# EasyEDA Pro project EMG_frontend.eprj, board EMG_channel_final_1
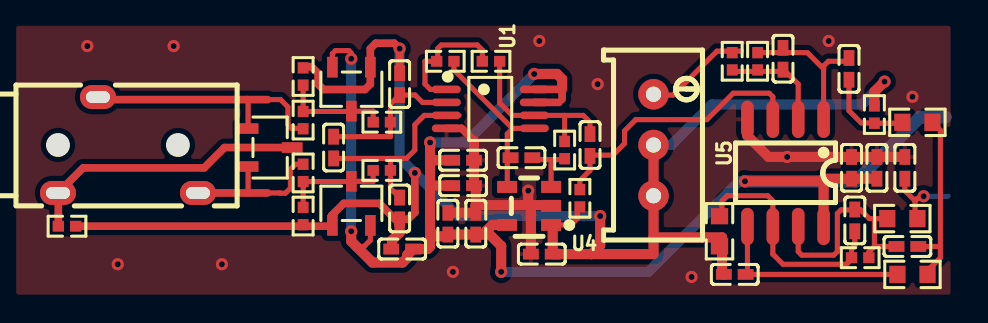
[diagram p4: board, top side]
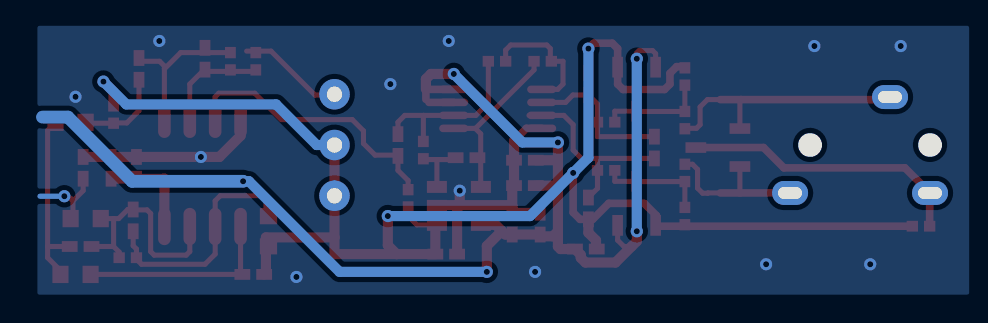
[diagram p5: board, bottom side, seen from below]

Outline 7.19 x 1.19 mm; copper layers: Top Layer, Bottom Layer. Coordinates in mm from the lower left corner of the outline.
Stack: Top Layer 0.035mm / Dielectric1 1.51mm FR4 er 4.5 / Bottom Layer 0.035mm

## Design rules (mm)
template: JLCPCB Capability(Two Layers Board)
spacing copperThickness1oz (default): track to track 0.102, other pairs 0.152 to 0.3
spacing copperThickness2oz: track to track 0.203, other pairs 0.152 to 0.3
track width copperThickness1oz (default): min 0.127, default 0.254, max 2.54
track width copperThickness2oz: min 0.203, default 0.254, max 2.54
differential pair differentialPair (default): width min 0.127, default 0.254, max 2.54; gap min 0.152, default 0.152
via viaSize (default): diameter min 0.5, default 0.61, max 10; hole min 0.3, default 0.305, max 6.3

## Placement (name value [footprint] x y rotation side)
C1  1uF  [C0402]  23.78 -0.04 0 top
C2  1uF  [C0402]  20.86 -1.44 0 top
C3  100nF  [C0402]  20.86 -0.17 0 top
C4  1uF  [C0402]  21.49 -3.34 90 top
C5  100nF  [C0402]  20.1 -3.34 90 top
C6  1uF  [C0402]  27.21 0.59 270 top
C7  1uF  [C0402]  40.16 4.4 270 top
C8  1nF  [C0402]  36.86 4.91 90 top
C9  1uF  [C0402]  40.29 -0.55 90 top
C10  100nF  [C0402]  41.56 -0.55 90 top
C11  10nF  [C0402]  43.08 -4.49 180 top
C12  10nF  [C0402]  34.45 -5.88 0 top
C13  1nF  [C0402]  40.45 -3.18 90 top
C14  1uF  [C0402]  42.96 -0.55 270 top
C15  10nF  [C0402]  14.38 0.47 90 top
C16  100pF  [C0402]  17.68 -2.58 270 top
C17  100pF  [C0402]  17.68 3.64 270 top
C18  100nF  [C0402]  24.8 -4.87 0 top
C19  100nF  [C0402]  17.81 -4.61 180 top
D1  PSM712-LF-T7  [SOT-23-3_L3.0-W1.7-P0.95-LS2.9-BR]  11.21 0.47 180 top
D3  BAV70  [SOT-23-3_L3.0-W1.7-P0.95-LS2.9-BR]  15.27 3.39 90 top
D4  BAV70  [SOT-23-3_L3.0-W1.7-P0.95-LS2.9-BR]  15.27 -2.33 270 top
J1  320B直插  [AUDIO-TH_PJ-3200]  4.09 0.59 0 top
R1  10kΩ  [R0402]  19.97 4.79 0 top
R2  10kΩ  [R0402]  22.26 4.79 180 top
R3  100kΩ  [R0402]  25.94 0.34 90 top
R4  100kΩ  [R0402]  26.7 -2.07 90 top
R5  100kΩ  [R0402]  41.43 2.12 270 top
R6  20kΩ  [RES-ADJ-TH_3P-L9.5-W4.85-P2.54_PV36W103C01B00]  30.38 0.59 0 top
R7  1kΩ  [R0402]  34.32 4.79 270 top
R8  100kΩ  [R0402]  35.59 4.79 90 top
R9  56kΩ  [R0603]  43.58 1.73 0 top
R10  330kΩ  [R0603]  43.34 -5.88 180 top
R11  3.9kΩ  [R0603]  33.69 -3.72 90 top
R12  10kΩ  [R0402]  40.72 -5.05 180 top
R13  3.9kΩ  [R0603]  42.83 -3.09 0 top
R19  1MΩ  [R0402]  12.86 4.02 90 top
R20  1MΩ  [R0402]  12.86 -2.96 90 top
R21  2kΩ  [R0402]  12.86 1.84 90 top
R22  2kΩ  [R0402]  1.05 -3.47 0 top
R23  2kΩ  [R0402]  12.86 -0.8 270 top
R24  2kΩ  [R0402]  16.79 -0.68 0 top
R25  2kΩ  [R0402]  16.79 1.74 0 top
U1  INA331AIDGKT  [VSSOP-8_L3.0-W3.0-P0.65-LS4.9-BL]  22.22 2.4 270 top
U4  TPMCP6001UT-I/OT  [SOT-23-5_L2.9-W1.6-P0.95-LS2.8-BR]  24.16 -2.45 0 top
U5  MCP6002M/TR  [SOP-8_L4.9-W3.9-P1.27-LS6.0-BL]  36.99 -0.8 180 top

## Footprints (pads in the part's own frame, mm; a bottom-side part is the same pattern mirrored in y, then rotated)
AUDIO-TH_PJ-3200
  oval 1.8x1.2 hole 1.2x0.6: 2(-1.5,2.4) 3(-3.5,-2.4) 4(3.5,-2.4)
C0402
  rect 0.79x0.54 smd: 1(-0.545,0) 2(0.545,0)
R0402
  rect 0.566x0.54 smd: 1(-0.433,0) 2(0.433,0)
R0603
  rect 0.806x0.864 smd: 1(-0.753,0) 2(0.753,0)
RES-ADJ-TH_3P-L9.5-W4.85-P2.54_PV36W103C01B00
  round 1.524 hole 0.762: 1(0,2.54) 2(0,0) 3(0,-2.54)
SOP-8_L4.9-W3.9-P1.27-LS6.0-BL
  oval 0.63x1.865 smd: 1(-1.905,-2.683) 2(-0.635,-2.683) 3(0.635,-2.683) 4(1.905,-2.683) 5(1.905,2.683) 6(0.635,2.683) 7(-0.635,2.683) 8(-1.905,2.683)
SOT-23-3_L3.0-W1.7-P0.95-LS2.9-BR
  rect 1.038x0.532 smd: 1(1.101,-0.95) 2(1.101,0.95) 3(-1.101,0)
SOT-23-5_L2.9-W1.6-P0.95-LS2.8-BR
  rect 1x0.6 smd: 1(1.1,-0.95) 2(1.1,0) 3(1.1,0.95) 4(-1.1,0.95) 5(-1.1,-0.95)
VSSOP-8_L3.0-W3.0-P0.65-LS4.9-BL
  oval 0.38x1.45 smd: 1(-0.975,-2.2) 2(-0.325,-2.2) 3(0.325,-2.2) 4(0.975,-2.2) 5(0.975,2.2) 6(0.325,2.2) 7(-0.325,2.2) 8(-0.975,2.2)

## Nets
As in the schematic.

## Via types
v1: diameter 0.61, hole 0.305, Top Layer to Bottom Layer, 23 vias

## Routing (per net, layer and track width the routed paths; a pad name or vN(x,y) marks a point on that pad's centre or on a via; arc(x,y) is an arc through that point)
GND: length 22.7
  Top Layer w0.381: 20.02,1.43 20.79,1.43 21.4,0.81
  Top Layer w0.508: 24.25,-2.42 24.25,-2.42 24.25,-4.74 ; 24.25,-2.42 25.22,-2.42 U4.2 ; 24.25,-2.42 24.12,-2.29 v1(24.12,-1.69) ; 24.25,-2.42 21.49,-2.42 ; C5.2 C4.2 21.49,-2.42 ; 21.49,-2.42 21.49,-1.53 C2.2 C3.2 21.4,0.81 ; U5.4 35.08,1.05 36.14,0 v1(37.07,0) C9.2 C10.2 C14.1
  vias: v1(2.06,5.55) v1(3.59,-5.37) v1(6.38,5.55) v1(8.79,-5.37) v1(20.35,-5.76) v1(24.67,5.8) v1(27.59,3.64) v1(32.29,-6.01) v1(39.15,5.8) v1(43.34,3.01)
VCC: length 77.9
  Top Layer w0.254: v1(15.26,4.91) 15.26,5.2 15.14,5.32 14.47,5.32 14.32,5.17 D3.2 ; 16.22,-3.43 16.22,-4.17 15.91,-4.49 15.41,-4.49
  Top Layer w0.381: 25.81,2.88 25.81,3.39 25.8,3.38 U1.8 ; U1.7 25.66,2.73
  Top Layer w0.508: v1(19.21,0.72) 19.21,-0.27 ; 19.21,-0.27 19.31,-0.17 C3.1 ; 19.21,-0.27 19.21,-1.43 ; 25.81,3.39 25.81,3.9 25.56,4.15 v1(24.41,4.15) ; C2.1 19.21,-1.44 19.21,-1.43 ; v1(34.96,-1.22) 38.77,-1.22 38.89,-1.09 ; 22.02,-3.71 22.76,-4.46 v1(22.76,-5.76) ; 22.02,-3.71 22.32,-3.4 U4.5 ; 22.02,-3.71 21.84,-3.89 C4.1 C5.1 20.01,-3.98 19.46,-3.98 19.21,-3.72 ; v1(15.26,-3.72) 15.26,-4.22 16.33,-5.29 17.83,-5.29 18.07,-5.05 18.07,-4.9 C19.1 19.08,-4.61 19.21,-4.49 19.21,-3.72 ; 38.89,-1.09 C9.1 C10.1 ; 38.89,-1.09 U5.8 ; 19.21,-3.72 19.21,-1.43
  Bottom Layer w0.508: v1(15.26,4.91) v1(15.26,-3.72) ; v1(34.96,-1.22) 34.66,-1.22 30.13,-5.76 v1(22.76,-5.76) ; v1(24.41,4.15) 20.99,0.72 v1(19.21,0.72)
  Bottom Layer w0.635: v1(34.96,-1.22) 40.51,-1.22 43.72,1.99 44.99,1.99
C: length 14.3
  Top Layer w0.381: R22.1 0.61,-1.82 J1.3 1.85,-0.55 7.9,-0.55 8.92,0.47 D1.3
IN+: length 10.1
  Top Layer w0.254: 17.23,-0.08 R24.2 17.23,-1.58 C16.1 ; 17.23,-0.08 C15.1 ; 17.23,-0.08 18.03,-0.08 18.45,0.34 18.45,1.61 18.91,2.08 20.66,2.08
IN-: length 7.6
  Top Layer w0.254: 20.02,2.73 18.83,2.73 18.46,3.1 C17.2 17.23,2.64 R25.2 17.23,1.01 C15.2
L: length 7.9
  Top Layer w0.254: D1.2 10.11,-1.8 10.1,-1.81 ; 11.08,-1.8 11.7,-1.8 11.71,-1.82 11.97,-1.82 12.22,-1.56 12.22,-0.62 12.48,-0.37 R23.1
  Top Layer w0.381: 7.47,-1.81 11.08,-1.81
OUT: length 4.2
  Top Layer w0.254: v1(43.9,-1.97) 43.79,-2.07 43.59,-2.07 43.47,-2.2 ; 43.47,-2.2 43.46,-2.2 42.96,-1.69 C14.2 ; 43.47,-2.2 43.47,-2.91 43.77,-3.22
  Bottom Layer w0.254: v1(43.9,-1.97) 45.12,-1.97
OUT1: length 8.9
  Top Layer w0.254: C6.1 27.21,1.74 26.87,2.08 25.92,2.08 ; R2.1 22.69,2.7 23.31,2.08 25.92,2.08 ; R3.2 25.94,2.06 25.92,2.08
OUT1_HP: length 13.9
  Top Layer w0.254: R4.2 26.7,-1.18 27.21,-0.68 C6.2 27.25,0.09 28.35,0.09 28.93,0.67 28.93,1.3 29.49,1.86 33.05,1.86 34.37,3.19 36.17,3.19 36.35,3.01 U5.3
OUT2: length 7.5
  Top Layer w0.254: R8.2 38.08,5.22 38.89,4.4 ; 38.89,2.13 38.89,4.4 ; 38.89,4.4 38.89,4.55 39.13,4.79 40,4.79 C7.1
OUT2_HP: length 4.5
  Top Layer w0.254: R9.1 42.79,1.69 R5.2 41.42,1.7 40.77,1.7 40.16,2.31 C7.2
OUT3: length 11.1
  Top Layer w0.254: U5.7 37.62,-4.74 37.8,-4.92 39.4,-4.92 39.58,-4.74 39.58,-2.83 39.76,-2.65 40.31,-2.65 40.33,-2.63 ; 41.43,-3.09 41.43,-4.49 ; 41.43,-3.09 41.18,-3.09 40.72,-2.63 C13.2 ; 41.43,-3.09 R13.1 ; 41.43,-4.49 42.54,-4.49 ; 41.43,-4.49 41.16,-4.76 R12.1
R: length 13
  Top Layer w0.254: D1.1 10.11,2.81 10.04,2.87 ; R21.1 12.84,1.43 12.28,1.43 12.1,1.61 12.1,2.5 11.73,2.87 11.08,2.87
  Top Layer w0.381: 2.47,2.99 2.6,2.87 11.08,2.87
VREF: length 84.1
  Top Layer w0.254: R4.1 26.57,-2.63 26.57,-3.09 26.26,-3.4 U4.1
  Top Layer w0.381: 12.93,-3.47 14.28,-3.47 ; 12.93,-3.47 R20.1 ; 12.93,-3.47 R22.2 ; 14.28,-3.47 14.28,-2.94 14.89,-2.33 16.67,-2.33 17.47,-3.13 C16.2 18.1,-3.13 18.45,-2.78 v1(18.45,-0.8) ; 14.28,-3.47 D4.1 ; 30.51,-1.91 30.38,-1.78 ; 12.8,4.52 13.27,4.52 13.6,4.18 13.6,3.64 13.87,3.37 15.95,3.37 16.22,3.64 16.22,5.42 16.49,5.69 17.41,5.69 v1(17.68,5.42) C17.1
  Top Layer w0.508: v1(27.72,-2.96) 27.72,-4.43 27.28,-4.87 ; C16.2 17.68,-3.8 17.3,-4.18 17.3,-4.58 C19.2 ; C12.1 33.81,-5.79 33.81,-4.03 30.38,-4.03 ; v1(41.94,3.77) 41.43,3.26 R5.1 ; 30.38,-1.78 R6.2 ; 30.38,-4.03 30.38,-4.87 27.28,-4.87 ; 30.38,-4.03 30.38,-2.03 ; 27.28,-4.87 C18.2 ; 30.38,-2.03 30.51,-1.91 ; 30.38,-2.03 30.38,-1.91 ; U4.1 25.34,-3.48 25.34,-4.74
  Bottom Layer w0.508: R6.2 31.27,0.59 33.3,2.63 40.8,2.63 v1(41.94,3.77) ; 30.38,-1.44 30.38,-1.91 ; v1(27.72,-2.96) 20.6,-2.96 v1(18.45,-0.8) 17.68,-0.04 v1(17.68,5.42)
$1N782: length 3
  Top Layer w0.254: 25.26,-0.13 25.9,-0.13 25.94,-0.09 ; 25.26,-0.13 24.42,-0.13 C1.2 ; 25.26,-0.13 U4.3
$1N800: length 8.7
  Top Layer w0.254: 23.33,1.43 23.33,1.41 23.07,1.16 23.07,-1.51 U4.4 ; 23.33,1.43 U1.5 ; 23.33,1.43 20.4,4.35 R1.2
$1N816: length 6.5
  Top Layer w0.254: 21.82,4.79 21.82,5.35 21.57,5.6 19.77,5.6 19.59,5.42 19.59,4.84 R1.1 18.95,4.79 18.95,3.64 19.22,3.38 20.02,3.38
$1N2150: length 5.2
  Top Layer w0.254: 34.78,5.29 33.56,5.29 31.36,3.09 30.51,3.09
$1N2207: length 4.9
  Top Layer w0.254: 34.46,4.28 36.99,4.28 37.62,3.64 37.62,2.13
$1N2765: length 9.9
  Top Layer w0.254: R10.2 35.08,-5.88 U5.5
$1N2767: length 9
  Top Layer w0.254: C11.1 44.72,-4.49 44.73,-4.48 ; 44.73,-4.48 44.73,1.33 44.34,1.73 ; 44.73,-4.48 44.73,-5.05 44.15,-5.63 44.15,-5.76
$1N3046: length 12.1
  Top Layer w0.254: C13.1 40.45,-4.45 40.29,-4.61 R12.2 40.29,-5.12 40.04,-5.37 36.86,-5.37 36.35,-4.87 U5.6 36.35,-2.2 36.1,-1.95 34.07,-1.95 33.81,-2.2 33.81,-3.16
$1N3779: length 5.3
  Top Layer w0.254: R19.1 R21.2 15.16,2.27 ; R25.1 16.36,2.29 D3.3
$1N3785: length 5.2
  Top Layer w0.254: D4.3 16.36,-1.22 R24.1 ; R20.2 R23.2 15.13,-1.24

## Copper pours and planes (outline as drawn; the poured copper is in the pictures)
GND on Top Layer: -1.49,6.56 45.24,6.56 45.24,-6.9 -1.49,-6.9
GND on Bottom Layer: -1.37,6.56 45.24,6.56 45.24,-6.9 -1.37,-6.9
